# Altium schematic sheet Leds.SchDoc
size A4
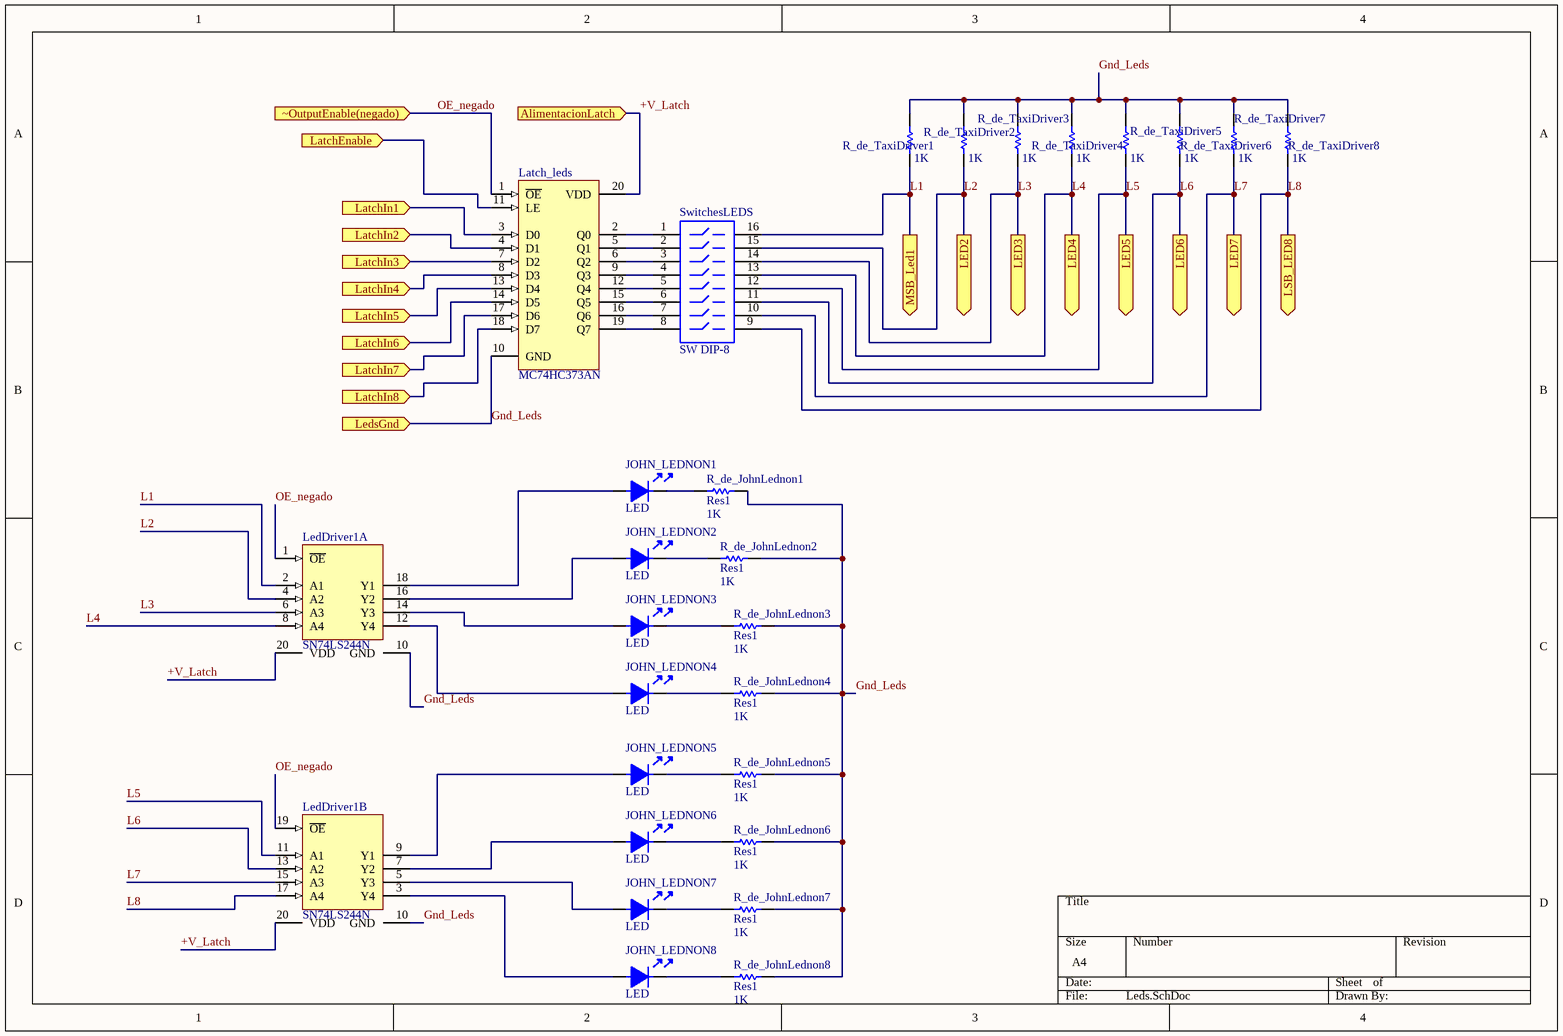
[diagram p0: Leds.SchDoc]

## Parts
JOHN_LEDNON1  LED  [LED3]
JOHN_LEDNON2  LED  [LED3]
JOHN_LEDNON3  LED  [LED3]
JOHN_LEDNON4  LED  [LED3]
JOHN_LEDNON5  LED  [LED3]
JOHN_LEDNON6  LED  [LED3]
JOHN_LEDNON7  LED  [LED3]
JOHN_LEDNON8  LED  [LED3]
Latch_leds  MC74HC373AN  [738-03]
LedDriver1  SN74LS244N  [738-03]  (parts A,B of 2)
R_de_JohnLednon1  Res1  value 1K  [AXIAL-0.3]
R_de_JohnLednon2  Res1  value 1K  [AXIAL-0.3]
R_de_JohnLednon3  Res1  value 1K  [AXIAL-0.3]
R_de_JohnLednon4  Res1  value 1K  [AXIAL-0.3]
R_de_JohnLednon5  Res1  value 1K  [AXIAL-0.3]
R_de_JohnLednon6  Res1  value 1K  [AXIAL-0.3]
R_de_JohnLednon7  Res1  value 1K  [AXIAL-0.3]
R_de_JohnLednon8  Res1  value 1K  [AXIAL-0.3]
R_de_TaxiDriver1  value 1K  [AXIAL-0.3]  (hidden comment: Res1)
R_de_TaxiDriver2  value 1K  [AXIAL-0.3]  (hidden comment: Res1)
R_de_TaxiDriver3  value 1K  [AXIAL-0.3]  (hidden comment: Res1)
R_de_TaxiDriver4  value 1K  [AXIAL-0.3]  (hidden comment: Res1)
R_de_TaxiDriver5  value 1K  [AXIAL-0.3]  (hidden comment: Res1)
R_de_TaxiDriver6  value 1K  [AXIAL-0.3]  (hidden comment: Res1)
R_de_TaxiDriver7  value 1K  [AXIAL-0.3]  (hidden comment: Res1)
R_de_TaxiDriver8  value 1K  [AXIAL-0.3]  (hidden comment: Res1)
SwitchesLEDS  SW DIP-8  [DIP-16-KEY]

## Ports
AlimentacionLatch (in), LatchEnable (in), LatchIn1 (in), LatchIn2 (in), LatchIn3 (in), LatchIn4 (in), LatchIn5 (in), LatchIn6 (in), LatchIn7 (in), LatchIn8 (in), LED2 (out), LED3 (out), LED4 (out), LED5 (out), LED6 (out), LED7 (out), LedsGnd (in), LSB_LED8 (out), MSB_Led1 (out), ~OutputEnable(negado) (in)

## Nets
+V_Latch: Latch_leds.20(VDD) LedDriver1.20(VDD) ; port AlimentacionLatch  [also labelled VDD]
Gnd_Leds: Latch_leds.10(GND) LedDriver1.10(GND) R_de_JohnLednon1.2 R_de_JohnLednon2.2 R_de_JohnLednon3.2 R_de_JohnLednon4.2 R_de_JohnLednon5.2 R_de_JohnLednon6.2 R_de_JohnLednon7.2 R_de_JohnLednon8.2 R_de_TaxiDriver1.2 R_de_TaxiDriver2.2 R_de_TaxiDriver3.2 R_de_TaxiDriver4.2 R_de_TaxiDriver5.2 R_de_TaxiDriver6.2 R_de_TaxiDriver7.2 R_de_TaxiDriver8.2 ; port LedsGnd  [also labelled GND]
L1: LedDriver1.2(A1) R_de_TaxiDriver1.1 SwitchesLEDS.16 ; port MSB_Led1
L2: LedDriver1.4(A2) R_de_TaxiDriver2.1 SwitchesLEDS.15 ; port LED2
L3: LedDriver1.6(A3) R_de_TaxiDriver3.1 SwitchesLEDS.14 ; port LED3
L4: LedDriver1.8(A4) R_de_TaxiDriver4.1 SwitchesLEDS.13 ; port LED4
L5: LedDriver1.11(A1) R_de_TaxiDriver5.1 SwitchesLEDS.12 ; port LED5
L6: LedDriver1.13(A2) R_de_TaxiDriver6.1 SwitchesLEDS.11 ; port LED6
L7: LedDriver1.15(A3) R_de_TaxiDriver7.1 SwitchesLEDS.10 ; port LED7
L8: LedDriver1.17(A4) R_de_TaxiDriver8.1 SwitchesLEDS.9 ; port LSB_LED8
LatchEnable: Latch_leds.11(LE) ; port LatchEnable
LatchIn1: Latch_leds.3(D0) ; port LatchIn1
LatchIn2: Latch_leds.4(D1) ; port LatchIn2
LatchIn3: Latch_leds.7(D2) ; port LatchIn3
LatchIn4: Latch_leds.8(D3) ; port LatchIn4
LatchIn5: Latch_leds.13(D4) ; port LatchIn5
LatchIn6: Latch_leds.14(D5) ; port LatchIn6
LatchIn7: Latch_leds.17(D6) ; port LatchIn7
LatchIn8: Latch_leds.18(D7) ; port LatchIn8
OE_negado: Latch_leds.1(~{OE}) LedDriver1.1(~{OE}) LedDriver1.19(~{OE}) ; port ~OutputEnable(negado)
NetJOHN_LEDNON1_1: JOHN_LEDNON1.1 LedDriver1.18(Y1)
NetJOHN_LEDNON1_2: JOHN_LEDNON1.2 R_de_JohnLednon1.1
NetJOHN_LEDNON2_1: JOHN_LEDNON2.1 LedDriver1.16(Y2)
NetJOHN_LEDNON2_2: JOHN_LEDNON2.2 R_de_JohnLednon2.1
NetJOHN_LEDNON3_1: JOHN_LEDNON3.1 LedDriver1.14(Y3)
NetJOHN_LEDNON3_2: JOHN_LEDNON3.2 R_de_JohnLednon3.1
NetJOHN_LEDNON4_1: JOHN_LEDNON4.1 LedDriver1.12(Y4)
NetJOHN_LEDNON4_2: JOHN_LEDNON4.2 R_de_JohnLednon4.1
NetJOHN_LEDNON5_1: JOHN_LEDNON5.1 LedDriver1.9(Y1)
NetJOHN_LEDNON5_2: JOHN_LEDNON5.2 R_de_JohnLednon5.1
NetJOHN_LEDNON6_1: JOHN_LEDNON6.1 LedDriver1.7(Y2)
NetJOHN_LEDNON6_2: JOHN_LEDNON6.2 R_de_JohnLednon6.1
NetJOHN_LEDNON7_1: JOHN_LEDNON7.1 LedDriver1.5(Y3)
NetJOHN_LEDNON7_2: JOHN_LEDNON7.2 R_de_JohnLednon7.1
NetJOHN_LEDNON8_1: JOHN_LEDNON8.1 LedDriver1.3(Y4)
NetJOHN_LEDNON8_2: JOHN_LEDNON8.2 R_de_JohnLednon8.1
NetLatch_leds_2: Latch_leds.2(Q0) SwitchesLEDS.1
NetLatch_leds_5: Latch_leds.5(Q1) SwitchesLEDS.2
NetLatch_leds_6: Latch_leds.6(Q2) SwitchesLEDS.3
NetLatch_leds_9: Latch_leds.9(Q3) SwitchesLEDS.4
NetLatch_leds_12: Latch_leds.12(Q4) SwitchesLEDS.5
NetLatch_leds_15: Latch_leds.15(Q5) SwitchesLEDS.6
NetLatch_leds_16: Latch_leds.16(Q6) SwitchesLEDS.7
NetLatch_leds_19: Latch_leds.19(Q7) SwitchesLEDS.8

## Library data of the parts
Latch_leds = MC74HC373AN: Octal 3-State Non-Inverting Transparent Latch; Published: 15-Apr-2002; DatasheetVersion: Mar-2000; PackageVersion: 1996; PackageReference: 738-03; Publisher: Altium Limited; PackageDescription: DIP; 20 Leads; Row Spacing 7.62 mm; Pitch 2.54 mm; Code_JEDEC: MS-001-AD; ComponentLink1Description: Manufacturer Link; ComponentLink1URL: http://www.onsemi.com/; ComponentLink2Description: Datasheet; ComponentLink2URL: http://www.onsemi.com/pub/Collateral/MC74HC373A-D.PDF
LedDriver1 = SN74LS244N: Octal Buffer/Line Driver with 3-State Outputs; Published: 15-Apr-2002; DatasheetVersion: Rev. 6, Dec-1999; PackageVersion: 1996; PackageReference: 738-03; Publisher: Altium Limited; PackageDescription: DIP; 20 Leads; Row Spacing 7.62 mm; Pitch 2.54 mm; Code_JEDEC: MS-001-AD; ComponentLink1Description: Manufacturer Link; ComponentLink1URL: http://www.onsemi.com/; ComponentLink2Description: Datasheet; ComponentLink2URL: http://www.onsemi.com/pub/Collateral/SN74LS240-D.PDF
R_de_JohnLednon1-R_de_JohnLednon8 R_de_TaxiDriver1-R_de_TaxiDriver8 = Res1: Resistor; Published: 8-Jun-2000; LatestRevisionDate: 17-Jul-2002; LatestRevisionNote: Re-released for DXP Platform.; PackageReference: AXIAL-0.3; Publisher: Altium Limited; PackageDescription: Axial Device, Thru-Hole; 2 Leads; 0.3 in Pin Spacing
SwitchesLEDS = SW-DIP8: 4009 Series DIP Switch, Raised actuator; Published: 24-Mar-1999; LatestRevisionDate: 17-Dec-2003; LatestRevisionNote: PCB Footprint replaced.; PackageReference: DIP-16-KEY; Publisher: Altium Limited; PackageDescription: DIP; 16 Leads; Row Spacing 7.62 mm; Pitch 2.54 mm; ComponentLink1Description: Manufacturer Link; ComponentLink1URL: http://www.oupiin.com/prodindx.html#Headers